# Altium schematic sheet tcrt5000.SchDoc
size A4
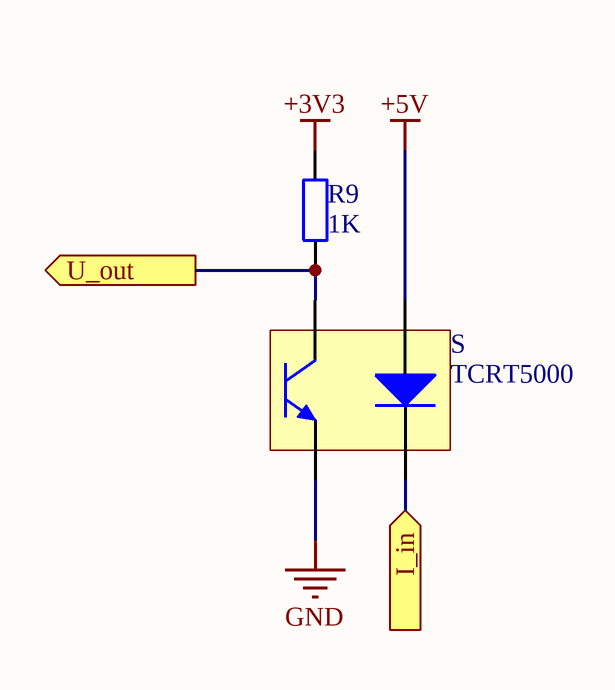
[diagram p0: tcrt5000.SchDoc]

## Parts
R9  1K  [FP_0805_RES]
S  TCRT5000  [TCRT5000_REV3]

## Ports
I_in (in), U_out (out)

## Nets
+3V3: R9.2
+5V: S.A
GND: S.E
I_in: S.K ; port I_in
U_out: R9.1 S.C ; port U_out

## Library data of the parts
R9 = RES: Resistor; Reference: R_collector; Value: 1K
S = TCRT5000: Reflective Photo Interrupter; Reference: 1470066; Supplier: Farnell